# EAGLE design Controller (EAGLE 9.6.1)
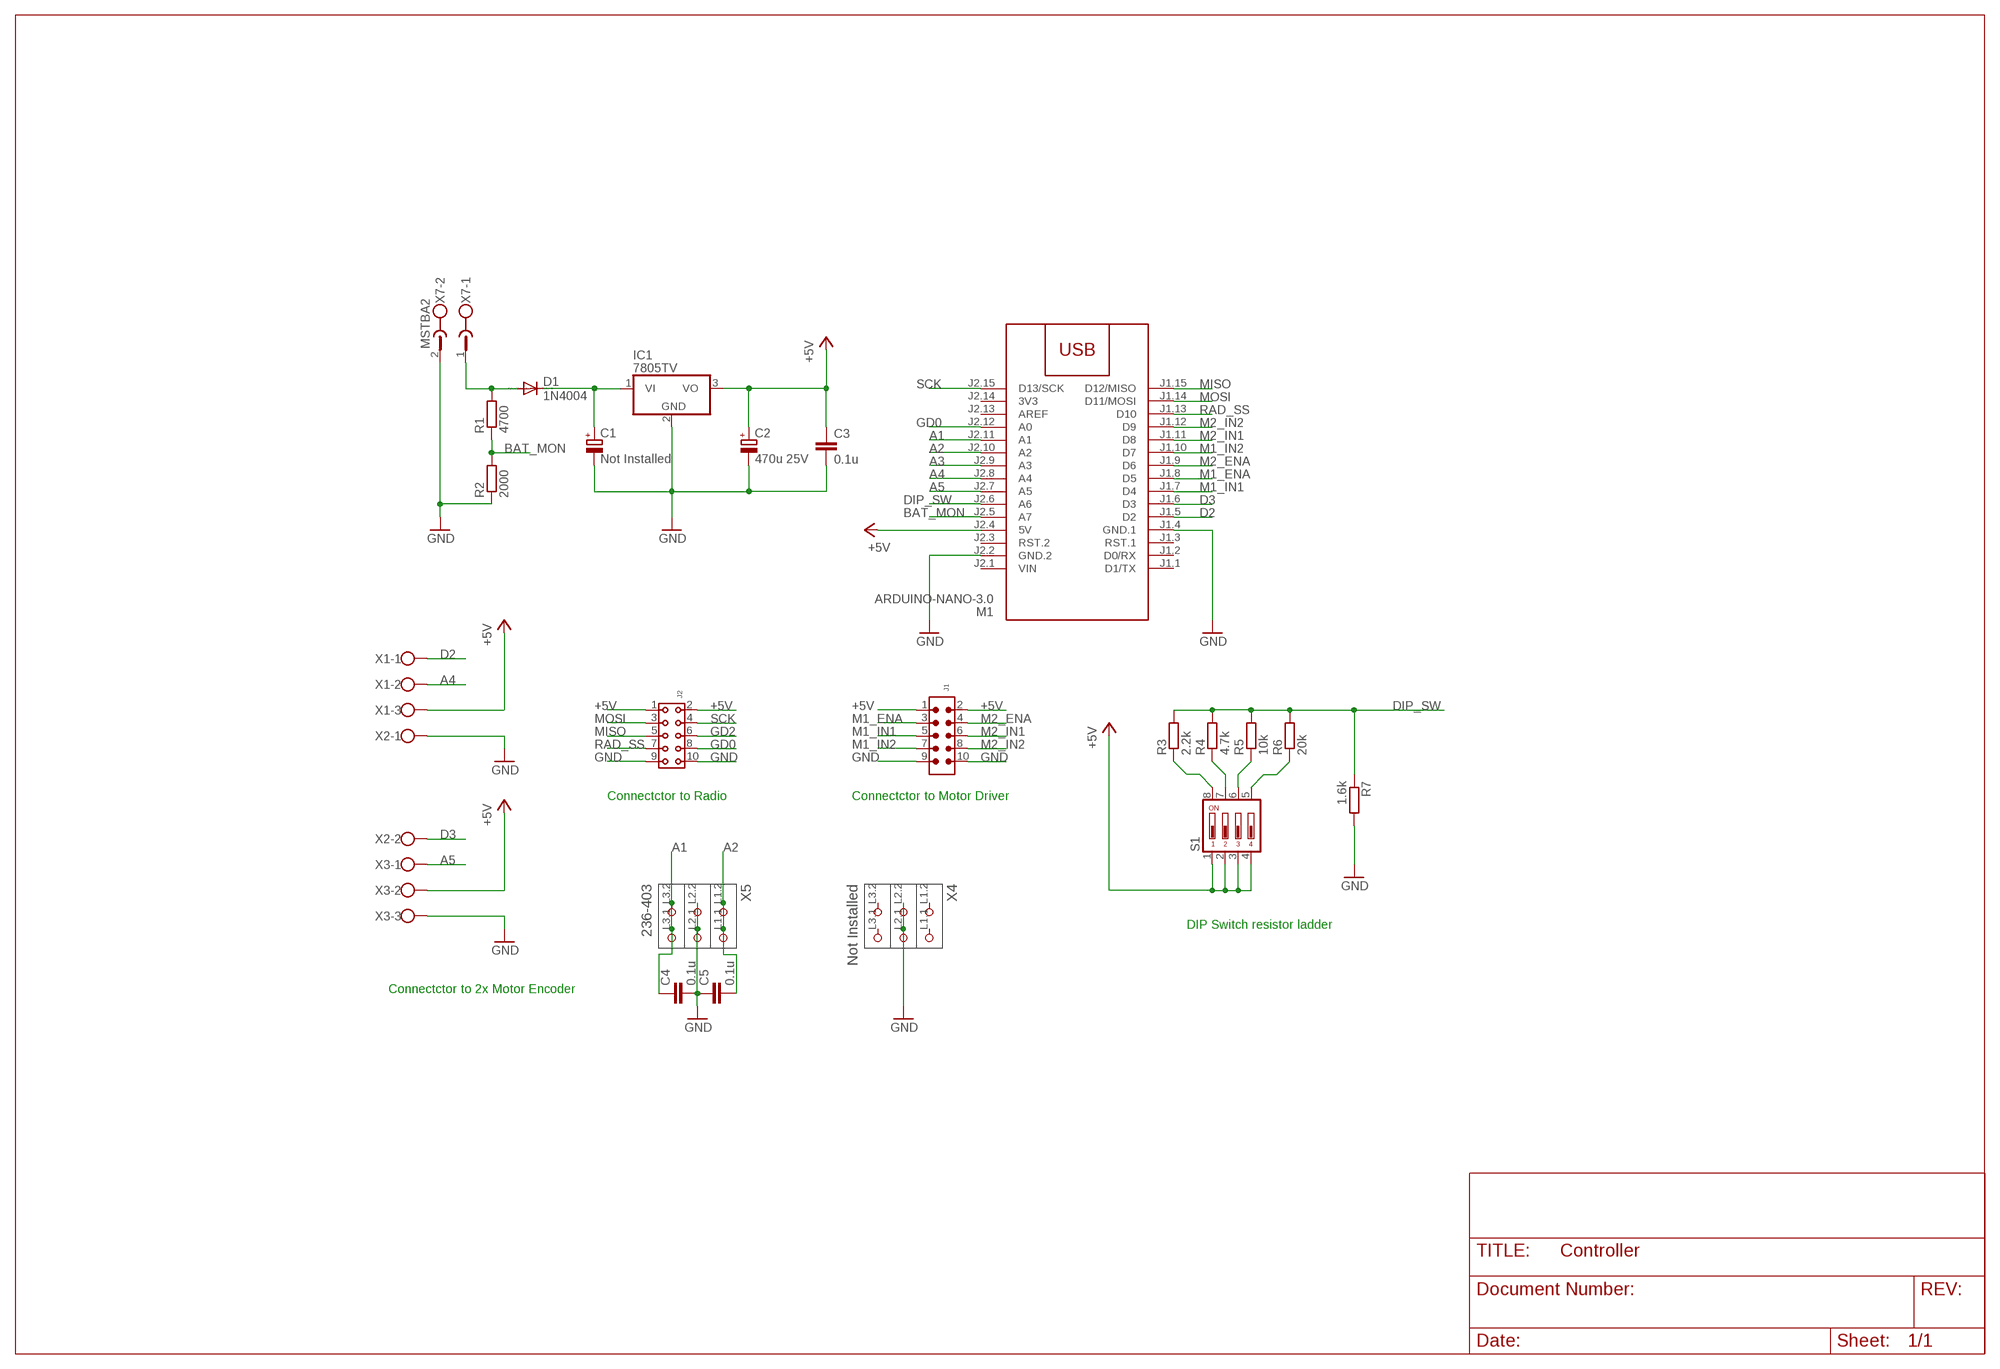
[diagram p0: schematic, sheet 1]

## Parts
C1  Not Installed  CPOL-EUE10-20  [EB20D]
C2  470u 25V  CPOL-EUE10-20  [EB20D]
C3  0.1u  C-EU050-030X075  [C050-030X075]
C4  0.1u  C-EU050-030X075  [C050-030X075]
C5  0.1u  C-EU050-030X075  [C050-030X075]
D1  1N4004  [DO41-10]
IC1  7805TV  [TO220V]
J1  6120XX21621_61201021621  [61201021621]
J2  6130XX21821_61301021821  [61301021821]
M1  ARDUINO-NANO-3.0  [ARDUINO-NANO-3.0]
R1  4700  R-EU_0207/12  [0207/12]
R2  2000  R-EU_0207/7  [0207/7]
R3  2.2k  R-EU_0207/5V  [0207/5V]
R4  4.7k  R-EU_0207/5V  [0207/5V]
R5  10k  R-EU_0207/5V  [0207/5V]
R6  20k  R-EU_0207/5V  [0207/5V]
R7  1.6k  R-EU_0207/5V  [0207/5V]
S1  DIP04YL  [DIP04YL]
X1  W237-103  [W237-103]
X2  W237-102  [W237-102]
X3  W237-103  [W237-103]
X4  Not Installed  236-403  [P-236-403]
X5  236-403  [P-236-403]
X7  MSTBA2  [MSTBA2]

## Nets
+5V: C2.+ C3.1 IC1.3(VO) J1.1 J1.2 J2.1 J2.2 M1.J2.4(5V) S1.1 S1.2 S1.3 S1.4 X1.3 X3.2
A1: C4.1 M1.J2.11(A1) X5.L3.1(P3.1) X5.L3.2(P3.2)
A2: C5.2 M1.J2.10(A2) X5.L1.1(P1.1) X5.L1.2(P1.2)
A3: M1.J2.9(A3)
A4: M1.J2.8(A4) X1.2
A5: M1.J2.7(A5) X3.1
BAT_MON: M1.J2.5(A7) R1.1 R2.2
D2: M1.J1.5(D2) X1.1
D3: M1.J1.6(D3) X2.2
DIP_SW: M1.J2.6(A6) R3.2 R4.2 R5.2 R6.2 R7.1
GD0: J2.8 M1.J2.12(A0)
GD2: J2.6
GND: C1.- C2.- C3.2 C4.2 C5.1 IC1.2(GND) J1.9 J1.10 J2.9 J2.10 M1.J1.4(GND.1) M1.J2.2(GND.2) R2.1 R7.2 X2.1 X3.3 X4.L2.1(P2.1) X4.L2.2(P2.2) X5.L2.1(P2.1) X5.L2.2(P2.2) X7.2
M1_ENA: J1.3 M1.J1.8(D5)
M1_IN1: J1.5 M1.J1.7(D4)
M1_IN2: J1.7 M1.J1.10(D7)
M2_ENA: J1.4 M1.J1.9(D6)
M2_IN1: J1.6 M1.J1.11(D8)
M2_IN2: J1.8 M1.J1.12(D9)
MISO: J2.5 M1.J1.15(D12/MISO)
MOSI: J2.3 M1.J1.14(D11/MOSI)
N$1: D1.A R1.2 X7.1
N$3: C1.+ D1.C IC1.1(VI)
N$4: R4.1 S1.7
N$5: R5.1 S1.6
N$6: R6.1 S1.5
N$7: R3.1 S1.8
RAD_SS: J2.7 M1.J1.13(D10)
SCK: J2.4 M1.J2.15(D13/SCK)
Unconnected: M1.J1.1(D1/TX) M1.J1.2(D0/RX) M1.J1.3(RST.1) M1.J2.3(RST.2) M1.J2.13(AREF) X4.L1.1(P1.1) X4.L1.2(P1.2) X4.L3.1(P3.1) X4.L3.2(P3.2)

## Notes on the sheet
- Connectctor to Radio | Connectctor to Motor Driver
- DIP Switch resistor ladder
- Connectctor to 2x Motor Encoder

## Power pins joined to a net without a drawn wire
3V3: M1.J2.14(3V3)
VIN: M1.J2.1(VIN)

## Library data of the parts
C1 C2 = resistor:CPOL-EU: POLARIZED CAPACITOR, European symbol
C3-C5 = rcl:C-EU: CAPACITOR, European symbol; SPICEPREFIX: C
D1 = diode:1N4004: DIODE general purpose rectifier, 1 A
IC1 = linear:78*: Positive VOLTAGE REGULATOR Source: http://cache.national.com/ds/LM/LM78L05.pdf http://www.fairchildsemi.com/ds/LM/LM7805.pdf
J1 = Wurth_Connectors_WR-BHD:6120XX21621_61201021621: WR-BHD 2.54 mm Male Box Header KIND PROPERTIES: Pitch 2.54 mm Gender:Male MATERIAL PROPERTIES: Insulator Material:PBT Insulator Flammability Rating UL94 V-0 Insulator Color:Black Contact Material :Copper Alloy Contact Plating :Gold Contact Type: Stamped GENERAL INFORMATION: Operating Temperature:-40 °C up to +125 °C Compliance:RoHS Working Voltage: 250 V (AC) Withstanding Voltage:500 V (AC) Contact Resistance: 20 mΩ Insulation Resistance:1000 MΩ CERTIFICATION: UL Approval:E323964 PACKAGING PROPERTIES Packaging :Tray <https://katalog.we-online.com/media/images/v2/o32884v209%20Family_WR-BHD_6120xx21621.jpg> Details see: https://katalog.we-online.com/en/em/BHD_2_54_MALE_BOX_HEADER_6120XX21621 Updated by Yingchun,Shan 2019-10-29 2019 (C) Würth Elektronik; CONTACT-RESISTANCE: 20mOhm; DATASHEET-URL: https://katalog.we-online.com/em/datasheet/61201021621.pdf; GENDER: Male; IR: 3A; L: 20.36mm; MATES: WR-BHD 2.54mm Female IDC Connector with Strain Relief; MOUNT: THT; PACKAGING: Tray; PART-NUMBER: 61201021621; PINS: 10; PITCH: 2.54mm; TOL-R: max.; TYPE: Straight; WORKING-VOLTAGE: 250V(AC)
J2 = Wurth_Connectors_WR-PHD:6130XX21821_61301021821: WR-PHD 2.54 mm Dual Socket Header ARTICLE PROPERTIES: Pins:4;​ 6;​ 8;​ 10;​ 12;​ 14;​ 16;​ 18;​ 20;​ 22;​ 24;​ 26;​ 28;​ 30;​ 32;​ 34;​ 36;​ 40;​ 44;​ 64;​ 72 KIND PROPERTIES: Pitch：2.54 mm Quality Class:3 as per CECC 75 301-802 Rows：Dual Gender：Socket Header Type：Straight MATERIAL PROPERTIES: Insulator Material :PBT Insulator Flammability Rating:UL94 V-0 Contact Material:Copper Alloy Contact Plating:Gold Contact Type:Stamped GENERAL INFORMATION Operating Temperature:-40 up to +125 °C Compliance:Lead free / RoHS ELECTRICAL PROPERTIES: Rated Current:3 A IR 1:3 A Withstanding Voltage:500 V (AC) Contact Resistance:20 mΩ RISO:1000 MΩ CERTIFICATION UL Approval:E323964 PACKAGING PROPERTIES Packaging:Tray <https://katalog.we-online.com/media/images/v2/o57948v209%20Family_Dual_Socket_Header_WR-PHD_6130xx21821.jpg> Details see: https://katalog.we-online.com/en/em/PHD_2_54_DUAL_SOCKET_HEADER_6130XX21821 Updated by Yingchun,Shan 2019-10-21 2019 (C) Würth Elektronik; DATASHEET-URL: https://katalog.we-online.com/em/datasheet/61301021821.pdf; GENDER: Socket Header; IR: 3A; MATES: WR-PHD 2.54mm SMT Dual Pin Header/THT Angled Dual Pin Header/THT Dual Board Stacker/THT Dual Pin Header; PACKAGING: Tray; PART-NUMBER: 61301021821; PINS: 10; ROWS: Dual; TYPE: Straight
M1 = diy-modules:ARDUINO-NANO-3.0: Arduino Nano 3.0 and compatible devices More details available here: https://www.arduino.cc/en/Main/ArduinoBoardNano Click here to find device on ebay.com <http://www.ebay.com/sch/arduino+nano>
R1-R7 = resistor:R-EU_: RESISTOR, European symbol
S1 = switch-dil:DIP04YL: DIL/CODE SWITCH; OC_FARNELL: unknown; OC_NEWARK: unknown
X1 X3 = con-wago-500:W237-103: WAGO SCREW CLAMP; MPN: 237-103; OC_FARNELL: unknown; OC_NEWARK: 18M7116
X2 = con-wago-500:W237-102: WAGO SCREW CLAMP; MPN: 237-102; OC_FARNELL: unknown; OC_NEWARK: 70K9898
X4 X5 = con-wago_236:236-403: Serie 236, Klemmenleiste für Leiterplatten 2 Lötstifte/Pol / Series 236, PCB terminal strip 2 solder pins/pole Polzahl / Pole No.: 3 Rastermaß / Pitch: 5.08 mm Bemessungsspannung / Rated Voltage: 320 V Nennstrom / Nominal Current: 24 A Leiterquerschnitt / Conductor Size: 0.08 - 2.5 mm² Anschlusstechnik / Connection Technology: CAGE CLAMP® Lötstiftlänge: / Solder Pin Length: 4 mm Leitereinführung (zur Platine) / Conductor entry angle (to PCB): 45 ° Farbe / Color: grau / gray Stand: 01.01.2012. Die jeweils aktuellen Daten zu diesem Artikel finden Sie in unserem Produktkatalog, den Sie unter www.wago.com einsehen können. As of: 01/01/2012. Please find the newest data for this article in our product catalogue, which can be viewed under www.wago.com.
X7 = con-phoenix-508:MSTBA2: PHOENIX; MF: FARNELL; MPN: 1757242; OC_FARNELL: 3705171; OC_NEWARK: 71C4161

## Board
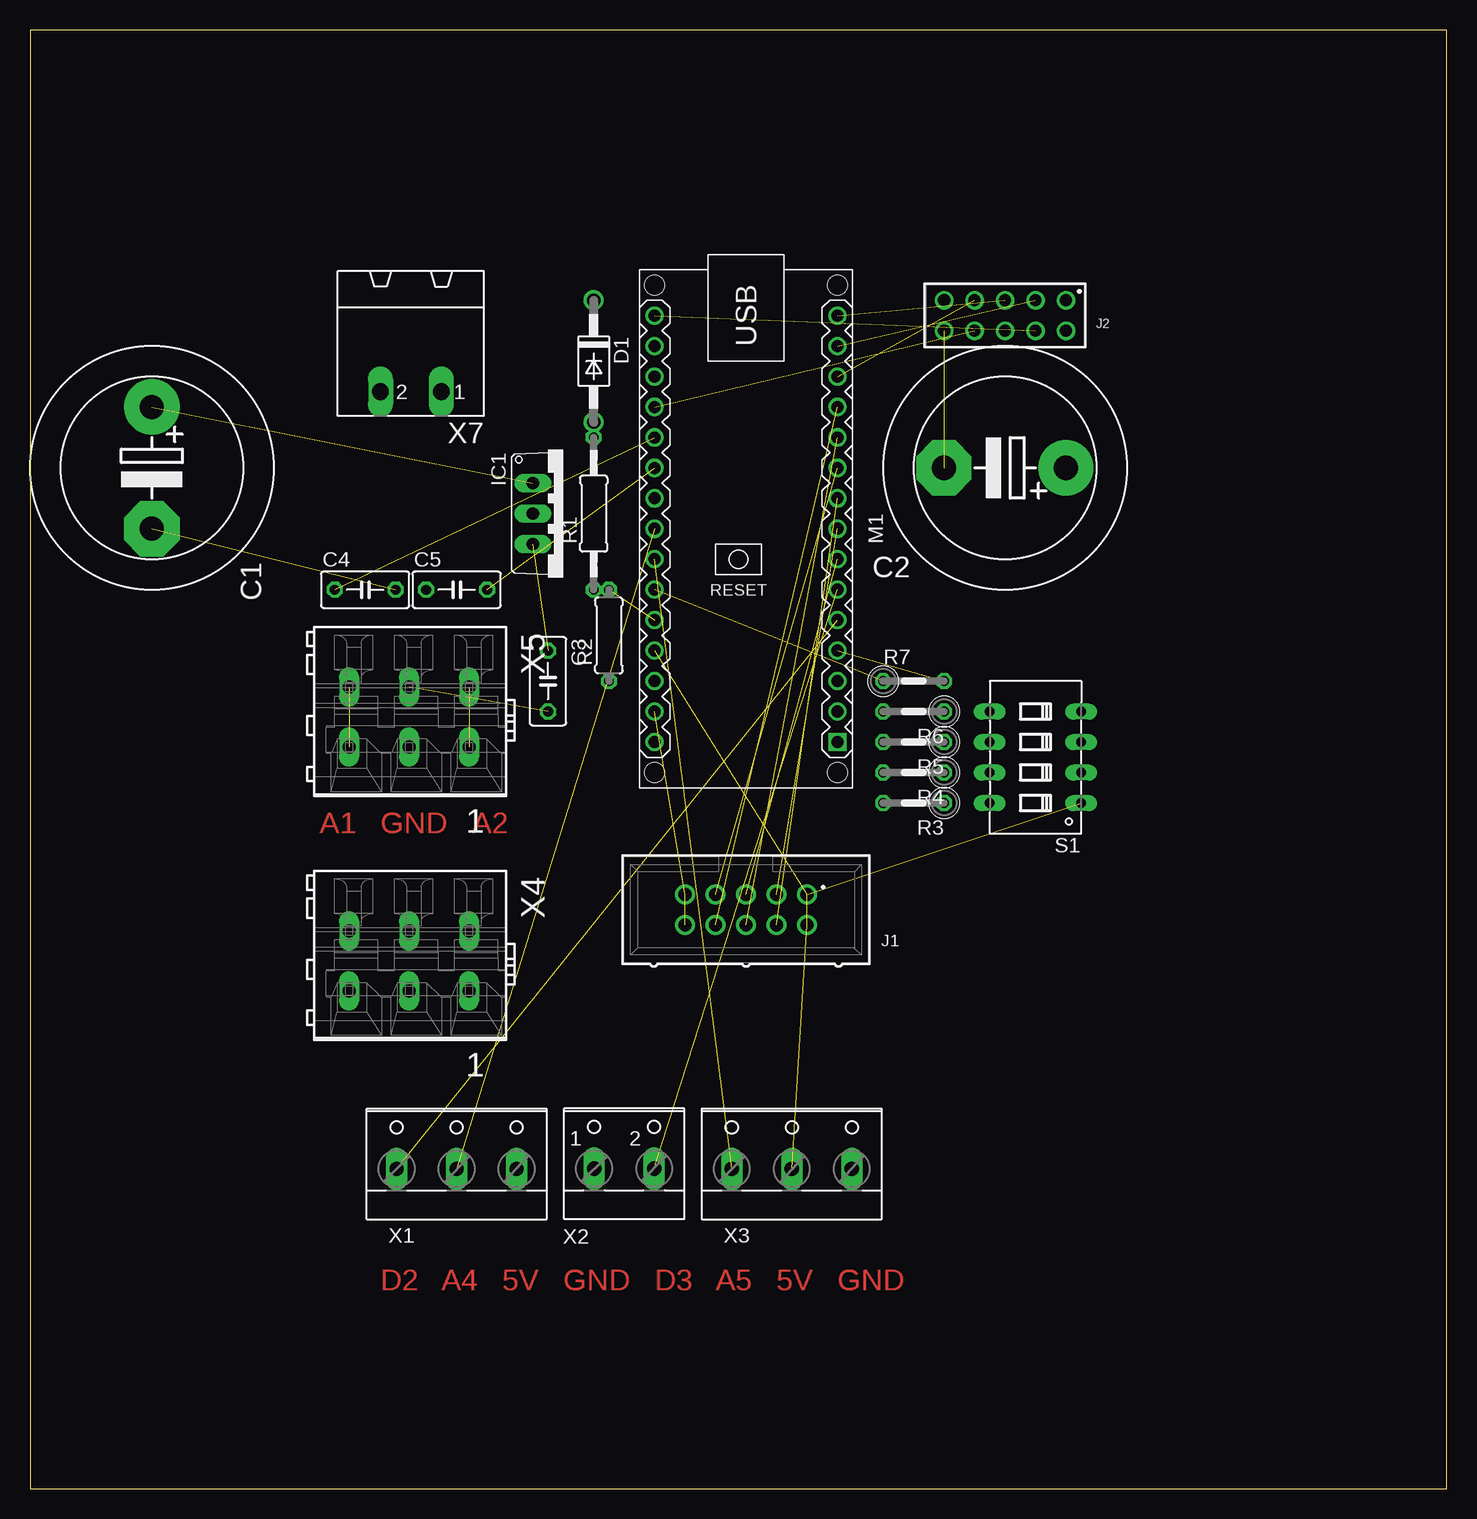
[diagram p1: board, top side]
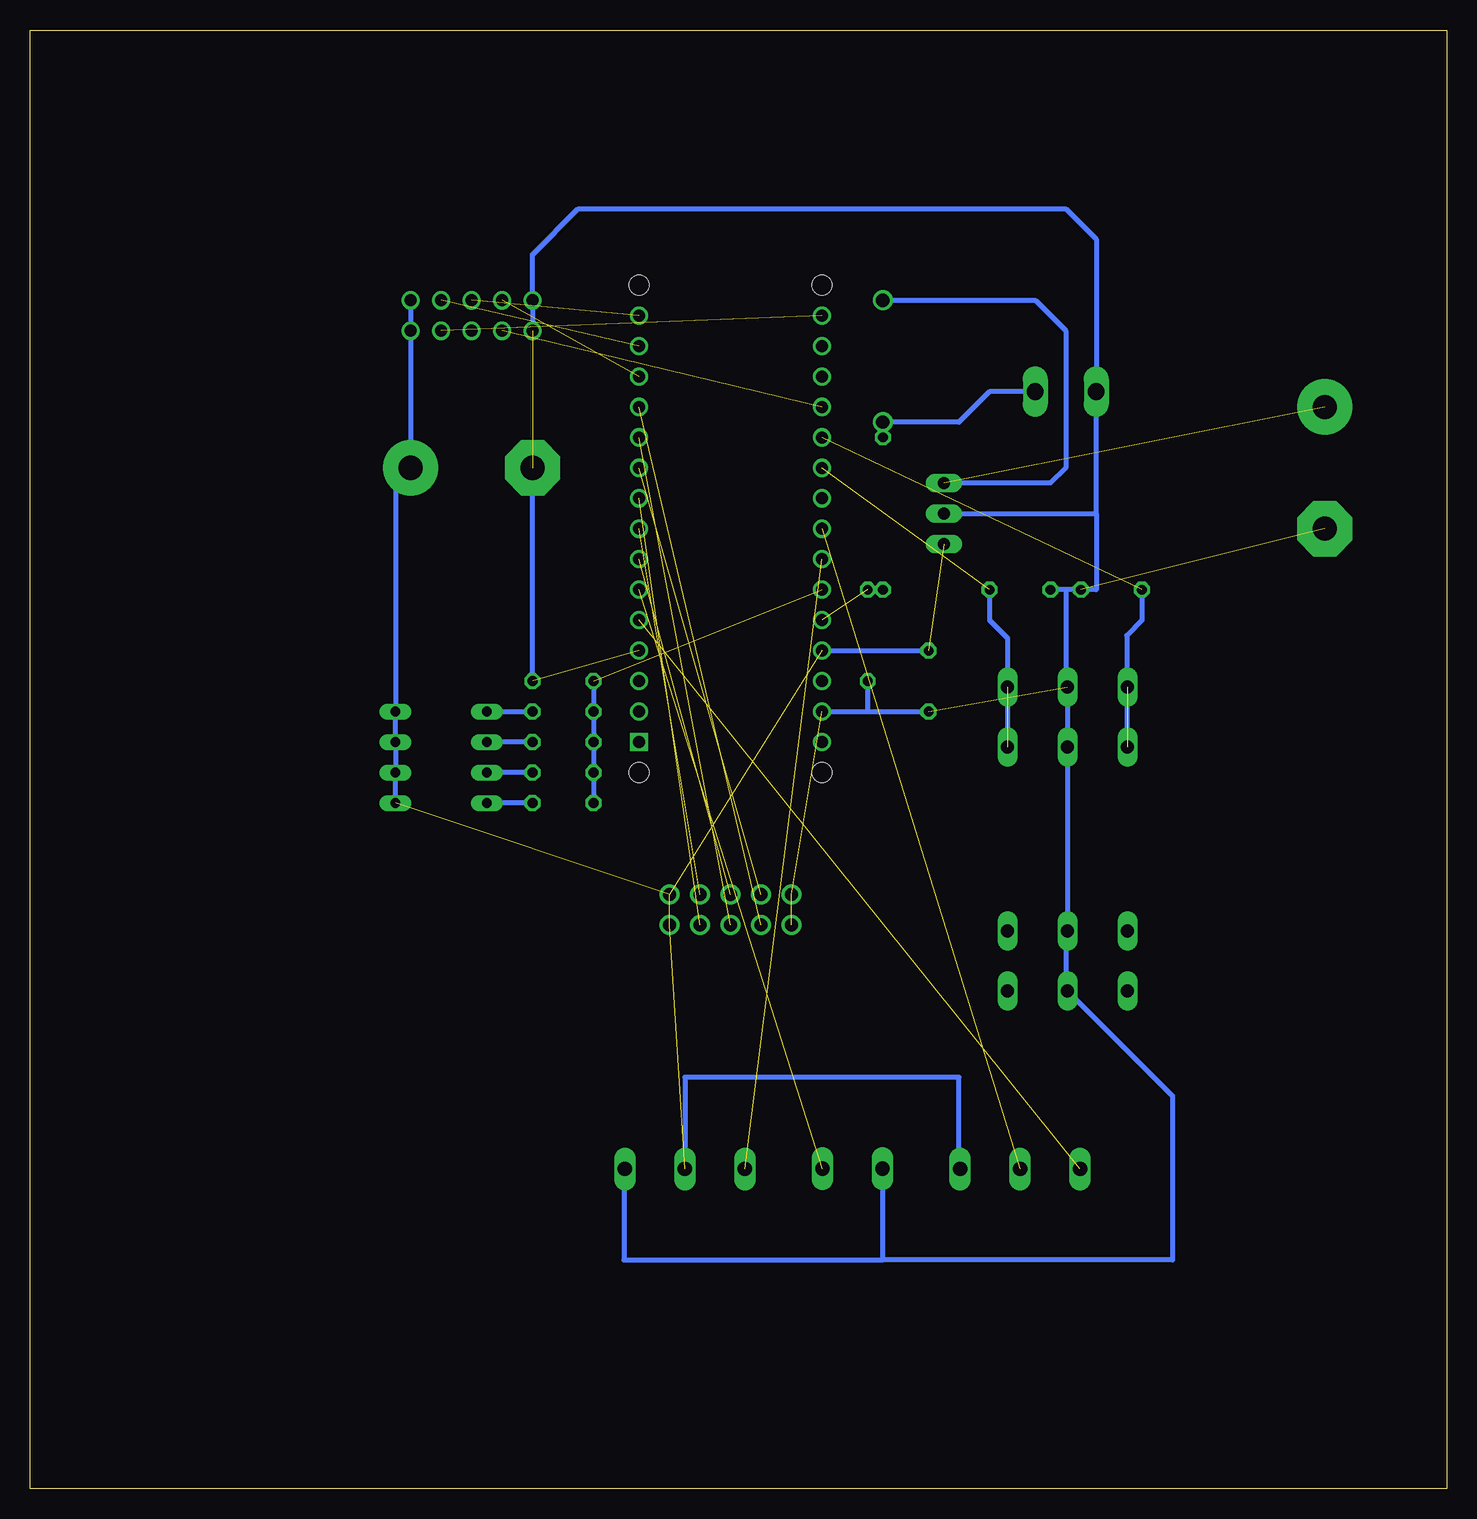
[diagram p2: board, bottom side, seen from below]

Size 118.09 x 121.59 mm. Coordinates in mm from the lower left corner, seen from the top.
Outline: 0,0 118.09,0 118.09,121.59 0,121.59 0,0
Copper layers (1*16): Top 0.035mm / dielectric 1.5mm / Bottom 0.035mm
Design rules "default": minimum track width 6mil, minimum drill 0.35mm, track to track 6mil, track to pad 6mil, pad to pad 6mil, via to via 6mil, smd to smd 6mil, copper to edge 40mil, drill to drill 6mil, minimum pad ring 10mil, minimum via ring 8mil, stop-mask expansion 4mil, vias tented up to drill 0mil, thermal gap 10mil

### Footprints (pad centres in the part's own frame; a part is rotated, then mirrored left to right if it is on the bottom)
EB20D = drill 2.007 pad 4.597: + -5.08,0 | drill 2.007 pad 4.597 octagon: - 5.08,0
C050-030X075 = drill 0.813 octagon: 1 -2.54,0; 2 2.54,0
DO41-10 = drill 1.118: A 5.08,0; C -5.08,0
TO220V = drill 1.016 long: 1 -2.54,-2.54; 2 0,-2.54; 3 2.54,-2.54
61201021621 = drill 1.1: 1 -5.08,-1.27; 2 -5.08,1.27; 3 -2.54,-1.27; 4 -2.54,1.27; 5 0,-1.27; 6 0,1.27; 7 2.54,-1.27; 8 2.54,1.27; 9 5.08,-1.27; 10 5.08,1.27
61301021821 = drill 1.02: 1 -5.08,-1.27; 2 -5.08,1.27; 3 -2.54,-1.27; 4 -2.54,1.27; 5 0,-1.27; 6 0,1.27; 7 2.54,-1.27; 8 2.54,1.27; 9 5.08,-1.27; 10 5.08,1.27
ARDUINO-NANO-3.0 = drill 1 square: J1.1 17.78,7.62 | drill 1: J1.2 15.24,7.62; J1.3 12.7,7.62; J1.4 10.16,7.62; J1.5 7.62,7.62; J1.6 5.08,7.62; J1.7 2.54,7.62; J1.8 0,7.62; J1.9 -2.54,7.62; J1.10 -5.08,7.62; J1.11 -7.62,7.62; J1.12 -10.16,7.62; J1.13 -12.7,7.62; J1.14 -15.24,7.62; J1.15 -17.78,7.62; J2.1 17.78,-7.62; J2.2 15.24,-7.62; J2.3 12.7,-7.62; J2.4 10.16,-7.62; J2.5 7.62,-7.62; J2.6 5.08,-7.62; J2.7 2.54,-7.62; J2.8 0,-7.62; J2.9 -2.54,-7.62; J2.10 -5.08,-7.62; J2.11 -7.62,-7.62; J2.12 -10.16,-7.62; J2.13 -12.7,-7.62; J2.14 -15.24,-7.62; J2.15 -17.78,-7.62 | hole 1.651: -20.32,7.62; -20.32,-7.62; 20.32,-7.62; 20.32,7.62
0207/12 = drill 0.813 octagon: 1 -6.35,0; 2 6.35,0
0207/7 = drill 0.813 octagon: 1 -3.81,0; 2 3.81,0
0207/5V = drill 0.813 octagon: 1 -2.54,0; 2 2.54,0
DIP04YL = drill 0.813 long: 1 -3.81,-3.81; 2 -1.27,-3.81; 3 1.27,-3.81; 4 3.81,-3.81; 5 3.81,3.81; 6 1.27,3.81; 7 -1.27,3.81; 8 -3.81,3.81
W237-103 = drill 1.194 long: 1 -5,-1.29; 2 0,-1.29; 3 5,-1.29
W237-102 = drill 1.194 long: 1 -2.5,-1.27; 2 2.5,-1.27
P-236-403 = drill 1.1 long: L1.1 2.957,4.85; L1.2 -2.043,4.85; L2.1 2.957,-0.15; L2.2 -2.043,-0.15; L3.1 2.957,-5.15; L3.2 -2.043,-5.15
MSTBA2 = drill 1.397 long: 1 -2.54,5.08; 2 2.54,5.08

### Placement (x,y rotation side)
C1  10.16,85.09 270 top
C2  81.28,85.09 180 top
C3  43.18,67.31 270 top
C4  27.94,74.93 0 top
C5  35.56,74.93 0 top
D1  46.99,93.98 270 top
IC1  44.45,81.28 270 top
J1  59.69,48.26 180 top
J2  81.28,97.79 180 top
M1  59.69,80.01 270 top
R1  46.99,81.28 90 top
R2  48.26,71.12 90 top
R3  73.66,57.15 180 top
R4  73.66,59.69 180 top
R5  73.66,62.23 180 top
R6  73.66,64.77 180 top
R7  73.66,67.31 0 top
S1  83.82,60.96 90 top
X1  35.56,27.94 0 top
X2  49.53,27.94 0 top
X3  63.5,27.94 0 top
X4  31.75,44.45 270 top
X5  31.75,64.77 270 top
X7  31.75,96.52 180 top

### Tracks (layer width: path | path; a pad name or v marks a point on that pad's centre or on a via)
+5V  (5 unrouted)
  Bottom 0.406: X1.3 40.64,26.73 40.64,34.29 63.5,34.29 X3.2 | M1.J2.4 C3.1 | S1.1 S1.2 S1.3 S1.4 87.63,83.82 C2.+ J2.2 J2.1
A1  (2 unrouted)
  Bottom 0.406: C4.1 25.4,72.39 26.67,71.12 26.67,61.88 X5.L3.1
A2  (2 unrouted)
  Bottom 0.406: C5.2 38.1,72.39 36.6,70.89 X5.L1.1
A4  (1 unrouted)
A5  (1 unrouted)
BAT_MON  (1 unrouted)
  Bottom 0.406: R2.2 R1.1
D2  (1 unrouted)
D3  (1 unrouted)
DIP_SW  (1 unrouted)
  Bottom 0.406: R7.1 R6.2 R5.2 R4.2 R3.2
GD0  (1 unrouted)
GND  (6 unrouted)
  Bottom 0.406: X3.3 68.58,26.57 68.58,19.05 46.99,19.05 | 46.99,19.05 46.99,26.63 X2.1 | M1.J2.2 48.26,64.77 | 48.26,64.77 C3.2 | 31.75,74.93 C4.2 29.21,74.93 29.21,81.28 | 31.75,74.93 C5.1 | 31.75,74.93 31.75,66.96 X5.L2.2 X5.L2.1 X4.L2.2 31.75,46.34 31.75,40.64 31.6,40.79 X4.L2.1 22.86,32.75 22.86,19.05 46.99,19.05 | R7.2 C2.- | J2.10 J2.9 76.2,102.87 72.39,106.68 31.75,106.68 29.21,104.14 X7.2 29.21,81.28 | IC1.2 29.21,81.28 | R2.1 48.26,64.77
M1_ENA  (1 unrouted)
M1_IN1  (1 unrouted)
M1_IN2  (1 unrouted)
M2_ENA  (1 unrouted)
M2_IN1  (1 unrouted)
M2_IN2  (1 unrouted)
MISO  (1 unrouted)
MOSI  (1 unrouted)
N$1
  Bottom 0.406: X7.1 38.1,91.44 40.64,88.9 D1.A R1.2
N$3  (1 unrouted)
  Bottom 0.406: D1.C 34.29,99.06 31.75,96.52 31.75,85.09 33.02,83.82 IC1.1
N$4
  Bottom 0.406: R4.1 S1.7
N$5
  Bottom 0.406: R5.1 S1.6
N$6
  Bottom 0.406: S1.5 R6.1
N$7
  Bottom 0.406: R3.1 S1.8
RAD_SS  (1 unrouted)
SCK  (1 unrouted)

### Text on the board
Top: A1 | GND | A2 | D2 | A4 | 5V | GND | D3 | A5 | 5V | GND